# EAGLE design shield-rs422-B (EAGLE 7.5.0)
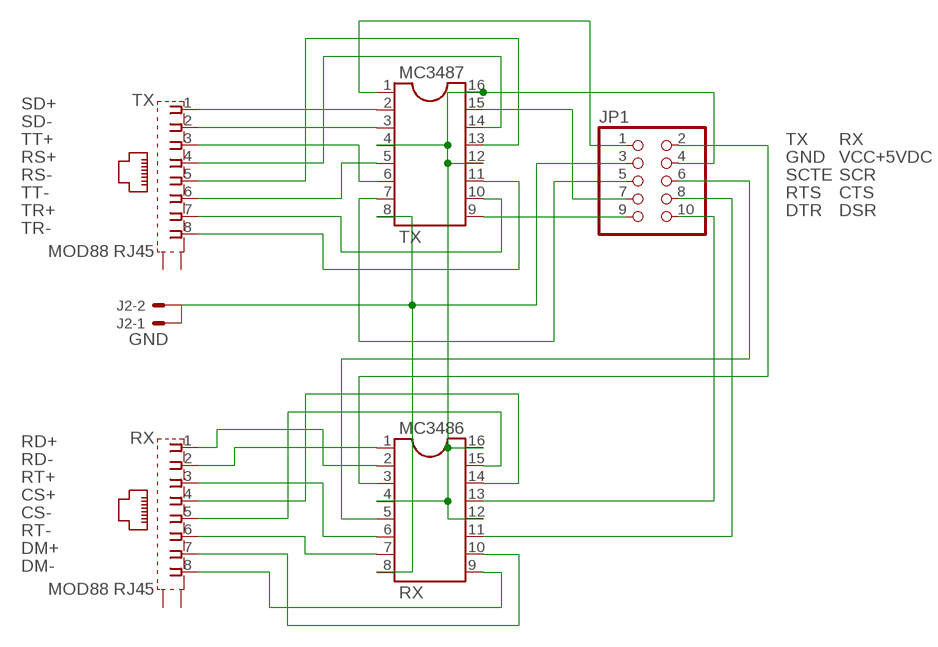
[diagram p0: schematic, sheet 1]

## Parts
J2  GND  22-05-7028-02  [7395-02]
JP1  PINHD-2X5/90  [2X05/90]
MC3486  RX  DIL16  [DIL16]
MC3487  TX  DIL16  [DIL16]
RX  MOD88 RJ45  GLX-S-88M  [GLX-S-88M]
TX  MOD88 RJ45  GLX-S-88M  [GLX-S-88M]

## Nets
CS+: MC3486.14 RX.4
CS-: MC3486.15 RX.5
CTS: JP1.8 MC3486.11
DM+: MC3486.10 RX.7
DM-: MC3486.9 RX.8
DSR: JP1.10 MC3486.13
DTR: JP1.9 MC3487.9
GND: J2.1 J2.2 JP1.3 MC3486.8 MC3487.8
RD+: MC3486.2 RX.1
RD-: MC3486.1 RX.2
RS+: MC3487.14 TX.4
RS-: MC3487.13 TX.5
RT+: MC3486.6 RX.3
RT-: MC3486.7 RX.6
RTS: JP1.7 MC3487.15
RX: JP1.2 MC3486.3
SCR: JP1.6 MC3486.5
SCTE: JP1.5 MC3487.7
SD+: MC3487.2 TX.1
SD-: MC3487.3 TX.2
TR+: MC3487.10 TX.7
TR-: MC3487.11 TX.8
TT+: MC3487.6 TX.3
TT-: MC3487.5 TX.6
TX: JP1.1 MC3487.1
VCC+5VDC: JP1.4 MC3486.4 MC3486.12 MC3486.16 MC3487.4 MC3487.12 MC3487.16
Unconnected: RX.S1 RX.S2 TX.S1 TX.S2

## Library data of the parts
J2 = con-molex:22-?-02: CONNECTOR wire to board 2.54 mm (.1 inch) pitch header; OC_FARNELL: 9731601; OC_NEWARK: unknown
JP1 = pinhead:PINHD-2X5: PIN HEADER
MC3486 MC3487 = ic-package:DIL16: Dual In Line / Socket
RX TX = con-kycon:GLX-S-88M: Mod. Jack, Right Angle, 8 posiotion, 8 contatcs RJ45 Source: GLX-S-88M.pdf; OC_FARNELL: unknown; OC_NEWARK: unknown

## Board
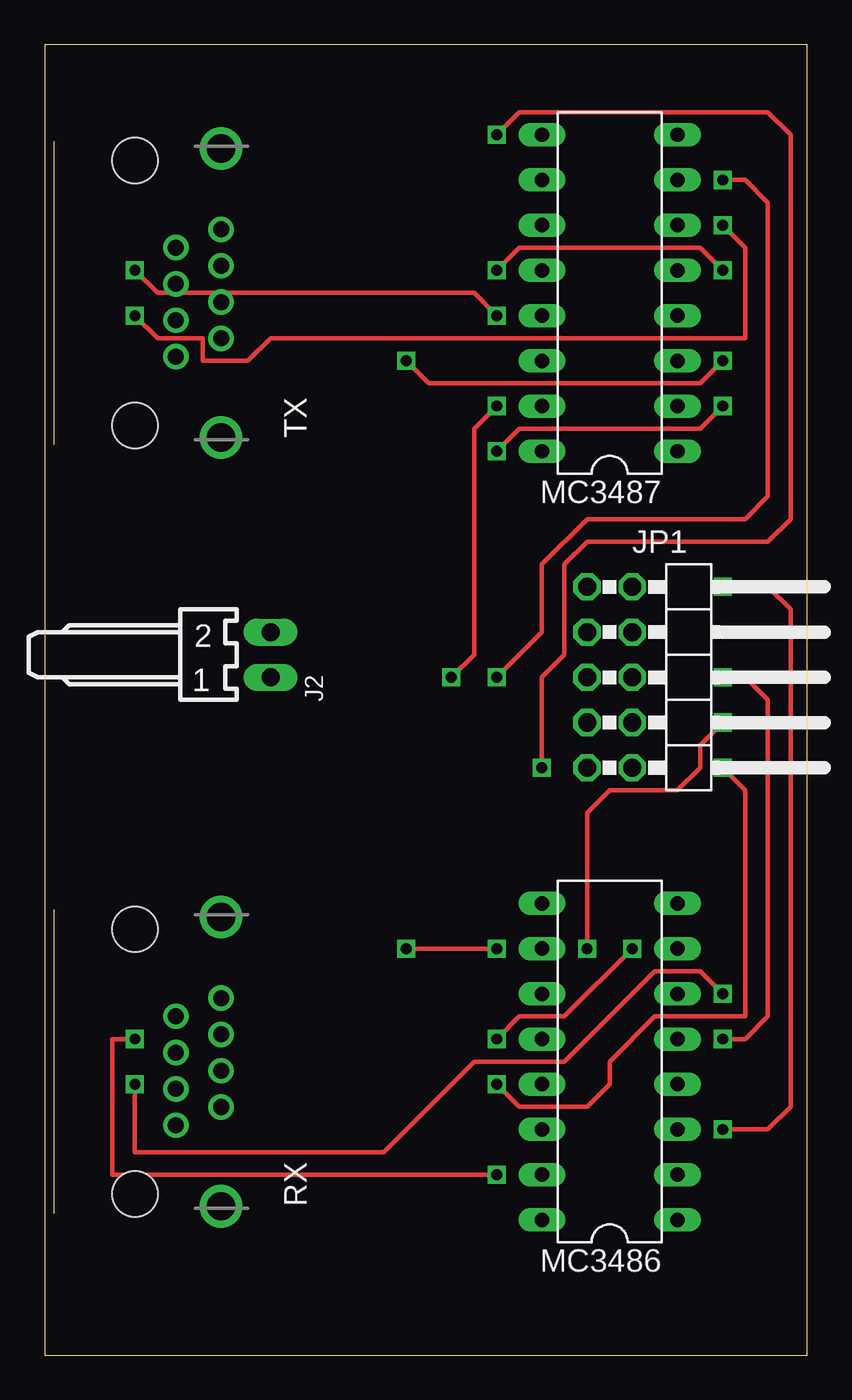
[diagram p1: board, top side]
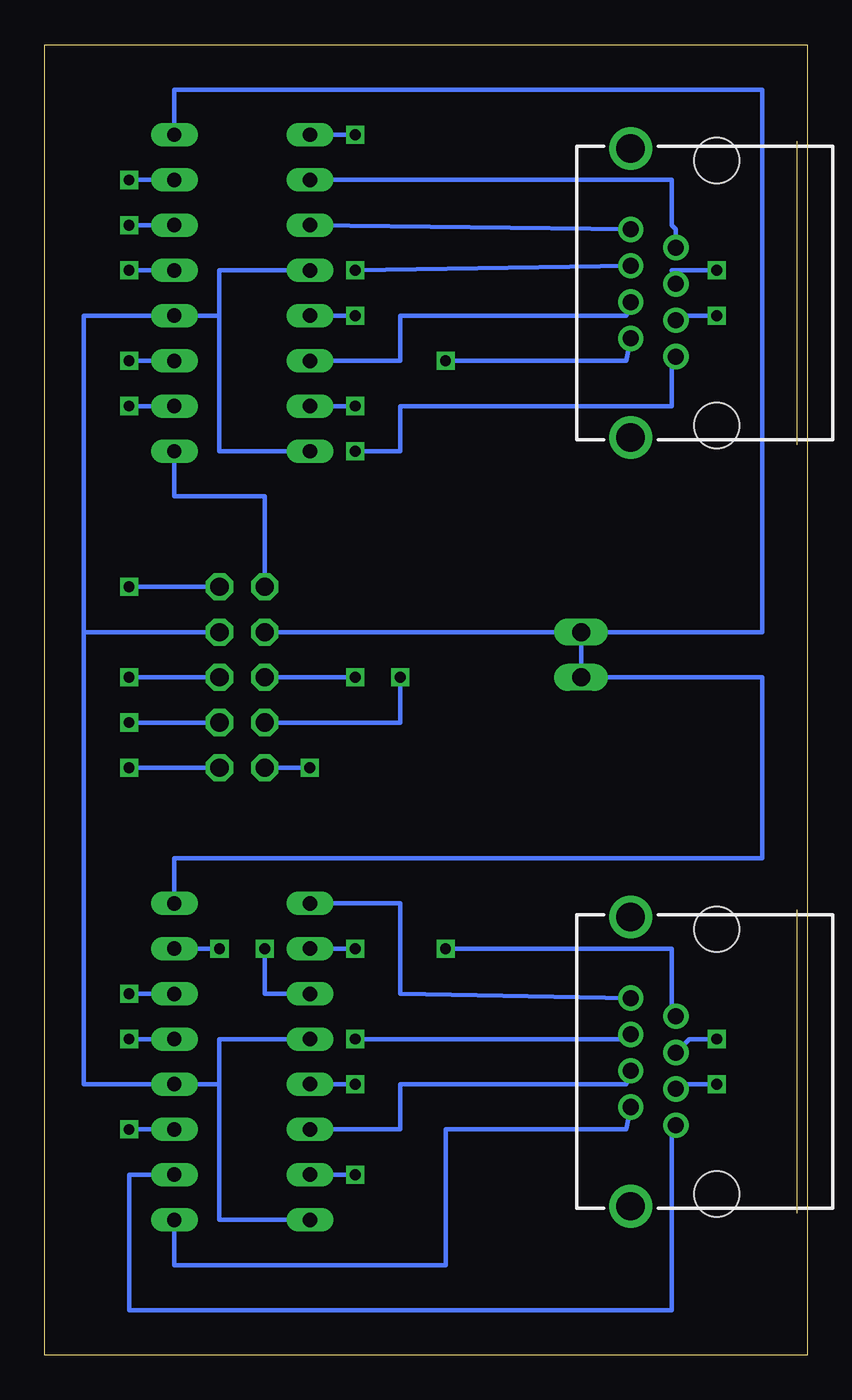
[diagram p2: board, bottom side, seen from below]

Size 42.85 x 73.65 mm. Coordinates in mm from the lower left corner, seen from the top.
Outline: 0,0 42.85,0 42.85,73.65 0,73.65 0,0
Copper layers (1*16): Top 0.035mm / dielectric 1.5mm / Bottom 0.035mm
Design rules "default": minimum track width 10mil, minimum drill 24mil, track to track 8mil, track to pad 8mil, pad to pad 8mil, via to via 8mil, smd to smd 8mil, copper to edge 40mil, drill to drill 8mil, minimum pad ring 10mil, minimum via ring 8mil, stop-mask expansion 4mil, vias tented up to drill 0mil, thermal gap 10mil

### Footprints (pad centres in the part's own frame; a part is rotated, then mirrored left to right if it is on the bottom)
7395-02 = drill 1.016 long: 1 1.27,0; 2 -1.27,0
2X05/90 = drill 1.016 octagon: 1 -5.08,-6.35; 2 -5.08,-3.81; 3 -2.54,-6.35; 4 -2.54,-3.81; 5 0,-6.35; 6 0,-3.81; 7 2.54,-6.35; 8 2.54,-3.81; 9 5.08,-6.35; 10 5.08,-3.81
DIL16 = drill 0.813 long: 1 -8.89,-3.81; 2 -6.35,-3.81; 3 -3.81,-3.81; 4 -1.27,-3.81; 5 1.27,-3.81; 6 3.81,-3.81; 7 6.35,-3.81; 8 8.89,-3.81; 9 8.89,3.81; 10 6.35,3.81; 11 3.81,3.81; 12 1.27,3.81; 13 -1.27,3.81; 14 -3.81,3.81; 15 -6.35,3.81; 16 -8.89,3.81
GLX-S-88M = drill 0.9 pad 1.422: 1 -3.57,-2.3; 2 -2.55,-4.84; 3 -1.53,-2.3; 4 -0.51,-4.84; 5 0.51,-2.3; 6 1.53,-4.84; 7 2.55,-2.3; 8 3.57,-4.84 | drill 1.6 pad 2.184: S1 -8.125,-4.84; S2 8.125,-4.84 | hole 2.55: -7.44,0; 7.44,0

### Placement (x,y rotation side)
J2  12.7,39.37 270 top
JP1  36.83,38.1 270 top
MC3486  31.75,16.51 90 top
MC3487  31.75,59.69 90 top
RX  5.08,16.51 90 top
TX  5.08,59.69 90 top

### Tracks (layer width: path | path; a pad name or v marks a point on that pad's centre or on a via)
CS+
  Bottom 0.254: RX.4 10.16,15.24 22.86,15.24 22.86,12.7 MC3486.14
CS-  (via drill 0.61)
  Top 0.254: v25.4,10.16 3.81,10.16 3.81,17.78 v5.08,17.78
  Bottom 0.254: MC3486.15 v25.4,10.16 | RX.5 6.62,17.78 v5.08,17.78
CTS  (via drill 0.61)
  Top 0.254: v38.1,35.56 36.83,34.29 36.83,33.02 35.56,31.75 31.75,31.75 30.48,30.48 v30.48,22.86
  Bottom 0.254: MC3486.11 30.48,20.32 v30.48,22.86 | JP1.8 v38.1,35.56
DM+  (via drill 0.61)
  Top 0.254: v20.32,22.86 v25.4,22.86
  Bottom 0.254: MC3486.10 v25.4,22.86 | RX.7 7.62,19.3 7.62,22.86 v20.32,22.86
DM-
  Bottom 0.254: MC3486.9 22.86,25.4 22.86,20.32 RX.8
DSR  (via drill 0.61)
  Top 0.254: v38.1,33.02 39.37,31.75 39.37,19.05 34.29,19.05 31.75,16.51 31.75,15.24 30.48,13.97 26.67,13.97 v25.4,15.24
  Bottom 0.254: JP1.10 v38.1,33.02 | MC3486.13 v25.4,15.24
DTR  (via drill 0.61)
  Top 0.254: v27.94,33.02 27.94,38.1 29.21,39.37 29.21,44.45 30.48,45.72 40.64,45.72 41.91,46.99 41.91,68.58 40.64,69.85 26.67,69.85 v25.4,68.58
  Bottom 0.254: MC3487.9 v25.4,68.58 | JP1.9 v27.94,33.02
GND
  Bottom 0.254: J2.2 J2.1 2.54,38.1 2.54,27.94 35.56,27.94 MC3486.8 | J2.2 JP1.3 | MC3487.8 35.56,71.12 2.54,71.12 2.54,40.64 J2.2
RD+
  Bottom 0.254: RX.1 7.62,12.7 7.62,2.54 38.1,2.54 38.1,10.16 MC3486.2
RD-
  Bottom 0.254: RX.2 10.16,12.7 20.32,12.7 20.32,5.08 35.56,5.08 MC3486.1
RS+
  Bottom 0.254: MC3487.14 22.86,55.88 22.86,58.42 10.16,58.42 TX.4
RS-  (via drill 0.61)
  Top 0.254: v5.08,60.96 6.35,59.69 24.13,59.69 v25.4,58.42
  Bottom 0.254: MC3487.13 v25.4,58.42 | TX.5 7.62,60.96 v5.08,60.96
RT+  (via drill 0.61)
  Top 0.254: v5.08,15.24 5.08,11.43 6.35,11.43 19.05,11.43 24.13,16.51 29.21,16.51 34.29,21.59 36.83,21.59 v38.1,20.32
  Bottom 0.254: MC3486.6 v38.1,20.32 | RX.3 7.12,15.24 v5.08,15.24
RT-  (via drill 0.61)
  Top 0.254: v33.02,22.86 29.21,19.05 26.67,19.05 v25.4,17.78
  Bottom 0.254: MC3486.7 v33.02,22.86 | RX.6 10.18,17.78 v25.4,17.78
RTS  (via drill 0.61)
  Top 0.254: v22.86,38.1 24.13,39.37 24.13,52.07 v25.4,53.34
  Bottom 0.254: MC3487.15 v25.4,53.34 | JP1.7 22.86,35.56 v22.86,38.1
RX  (via drill 0.61)
  Top 0.254: v38.1,12.7 40.64,12.7 41.91,13.97 41.91,41.91 40.64,43.18 v38.1,43.18
  Bottom 0.254: MC3486.3 v38.1,12.7 | JP1.2 v38.1,43.18
SCR  (via drill 0.61)
  Top 0.254: v38.1,38.1 39.37,38.1 40.64,36.83 40.64,19.05 39.37,17.78 v38.1,17.78
  Bottom 0.254: MC3486.5 v38.1,17.78 | JP1.6 v38.1,38.1
SCTE  (via drill 0.61)
  Top 0.254: v25.4,38.1 27.94,40.64 27.94,44.45 30.48,46.99 39.37,46.99 40.64,48.26 40.64,64.77 39.37,66.04 v38.1,66.04
  Bottom 0.254: MC3487.7 v38.1,66.04 | JP1.5 v25.4,38.1
SD+  (via drill 0.61)
  Top 0.254: v25.4,50.8 26.67,52.07 36.83,52.07 v38.1,53.34
  Bottom 0.254: MC3487.2 v38.1,53.34 | TX.1 7.62,55.88 7.62,53.34 22.86,53.34 22.86,50.8 v25.4,50.8
SD-  (via drill 0.61)
  Top 0.254: v20.32,55.88 21.59,54.61 36.83,54.61 v38.1,55.88
  Bottom 0.254: MC3487.3 v38.1,55.88 | TX.2 10.16,55.88 v20.32,55.88
TR+
  Bottom 0.254: MC3487.10 7.62,66.04 7.62,63.5 7.38,63.26 TX.7
TR-
  Bottom 0.254: MC3487.11 TX.8
TT+  (via drill 0.61)
  Top 0.254: v5.08,58.42 6.35,57.15 8.89,57.15 8.89,55.88 11.43,55.88 12.7,57.15 39.37,57.15 39.37,62.23 v38.1,63.5
  Bottom 0.254: MC3487.6 v38.1,63.5 | TX.3 7.62,58.42 v5.08,58.42
TT-  (via drill 0.61)
  Top 0.254: v25.4,60.96 26.67,62.23 36.83,62.23 v38.1,60.96
  Bottom 0.254: MC3487.5 v38.1,60.96 | TX.6 v25.4,60.96
TX
  Bottom 0.254: MC3487.1 35.56,48.26 30.48,48.26 JP1.1
VCC+5VDC
  Bottom 0.254: 33.02,58.42 MC3487.4 40.64,58.42 40.64,40.64 | 33.02,58.42 33.02,60.96 MC3487.12 | JP1.4 40.64,40.64 | 40.64,40.64 40.64,15.24 MC3486.4 33.02,15.24 | 33.02,15.24 33.02,17.78 MC3486.12 | MC3486.16 33.02,7.62 33.02,15.24 | MC3487.16 33.02,50.8 33.02,58.42